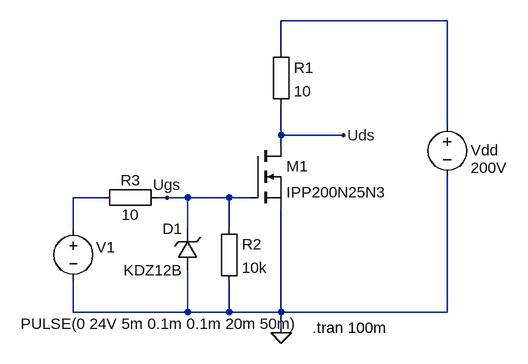
[diagram p0: schematic FET-switch-power.asc]
FET-switch-power.asc, the LTspice schematic file:
Version 4
SHEET 1 1292 680
WIRE -464 -288 -720 -288
WIRE -720 -240 -720 -288
WIRE -464 -128 -464 -288
WIRE -720 -112 -720 -160
WIRE -624 -112 -720 -112
WIRE -720 -96 -720 -112
WIRE -992 -16 -1040 -16
WIRE -896 -16 -912 -16
WIRE -864 -16 -896 -16
WIRE -800 -16 -864 -16
WIRE -768 -16 -800 -16
WIRE -1040 32 -1040 -16
WIRE -864 32 -864 -16
WIRE -800 32 -800 -16
WIRE -1040 160 -1040 112
WIRE -864 160 -864 96
WIRE -864 160 -1040 160
WIRE -800 160 -800 112
WIRE -800 160 -864 160
WIRE -720 160 -720 0
WIRE -720 160 -800 160
WIRE -464 160 -464 -48
WIRE -464 160 -720 160
WIRE -720 192 -720 160
FLAG -720 192 0
FLAG -624 -112 Uds
FLAG -896 -16 Ugs
SYMBOL voltage -464 -144 R0
WINDOW 123 0 0 Left 2
WINDOW 39 37 60 Left 2
WINDOW 0 36 55 Left 2
WINDOW 3 36 82 Left 2
SYMATTR InstName Vdd
SYMATTR Value 200V
SYMBOL voltage -1040 16 R0
WINDOW 123 0 0 Left 2
WINDOW 3 -81 162 Left 2
WINDOW 0 35 44 Left 2
SYMATTR Value PULSE(0 24V 5m 0.1m 0.1m 20m 50m)
SYMATTR InstName V1
SYMATTR SpiceLine Rser=10m
SYMBOL nmos -768 -96 R0
SYMATTR InstName M1
SYMATTR Value IPP200N25N3
SYMBOL Misc\\EuropeanResistor -736 -256 R0
SYMATTR InstName R1
SYMATTR Value 10
SYMBOL Misc\\EuropeanResistor -816 16 R0
SYMATTR InstName R2
SYMATTR Value 10k
SYMBOL Misc\\EuropeanResistor -896 -32 R90
WINDOW 0 5 56 VBottom 2
WINDOW 3 27 56 VTop 2
SYMATTR InstName R3
SYMATTR Value 10
SYMBOL zener -848 96 R180
WINDOW 0 24 64 Left 2
WINDOW 3 24 0 Left 2
SYMATTR InstName D1
SYMATTR Value KDZ12B
SYMATTR Description Diode
SYMATTR Type diode
TEXT -672 184 Left 2 !.tran 100m

The netlist it stands for:
* FET-switch-power.asc
Vdd N001 0 200V
V1 N002 0 PULSE(0 24V 5m 0.1m 0.1m 20m 50m) Rser=10m
M1 Uds Ugs 0 0 IPP200N25N3
R1 N001 Uds 10
R2 Ugs 0 10k
R3 Ugs N002 10
D1 0 Ugs KDZ12B
.model D D
.lib standard.dio
.model NMOS NMOS
.model PMOS PMOS
.lib standard.mos
.tran 100m
.backanno
.end